# Altium schematic sheet CPU.SchDoc: MC9S12C128 Connection Schematic
size B; Date: 2015-02-08; Author: Marcin Czajkowski; Organization: Marcin Czajkowski; Address1: SN:3547684; Address2: ESE - Year2; Address3: Conestoga College; Address4: Project IV; DocumentNumber: 1; Revision: D; SheetNumber: 1; SheetTotal: 14
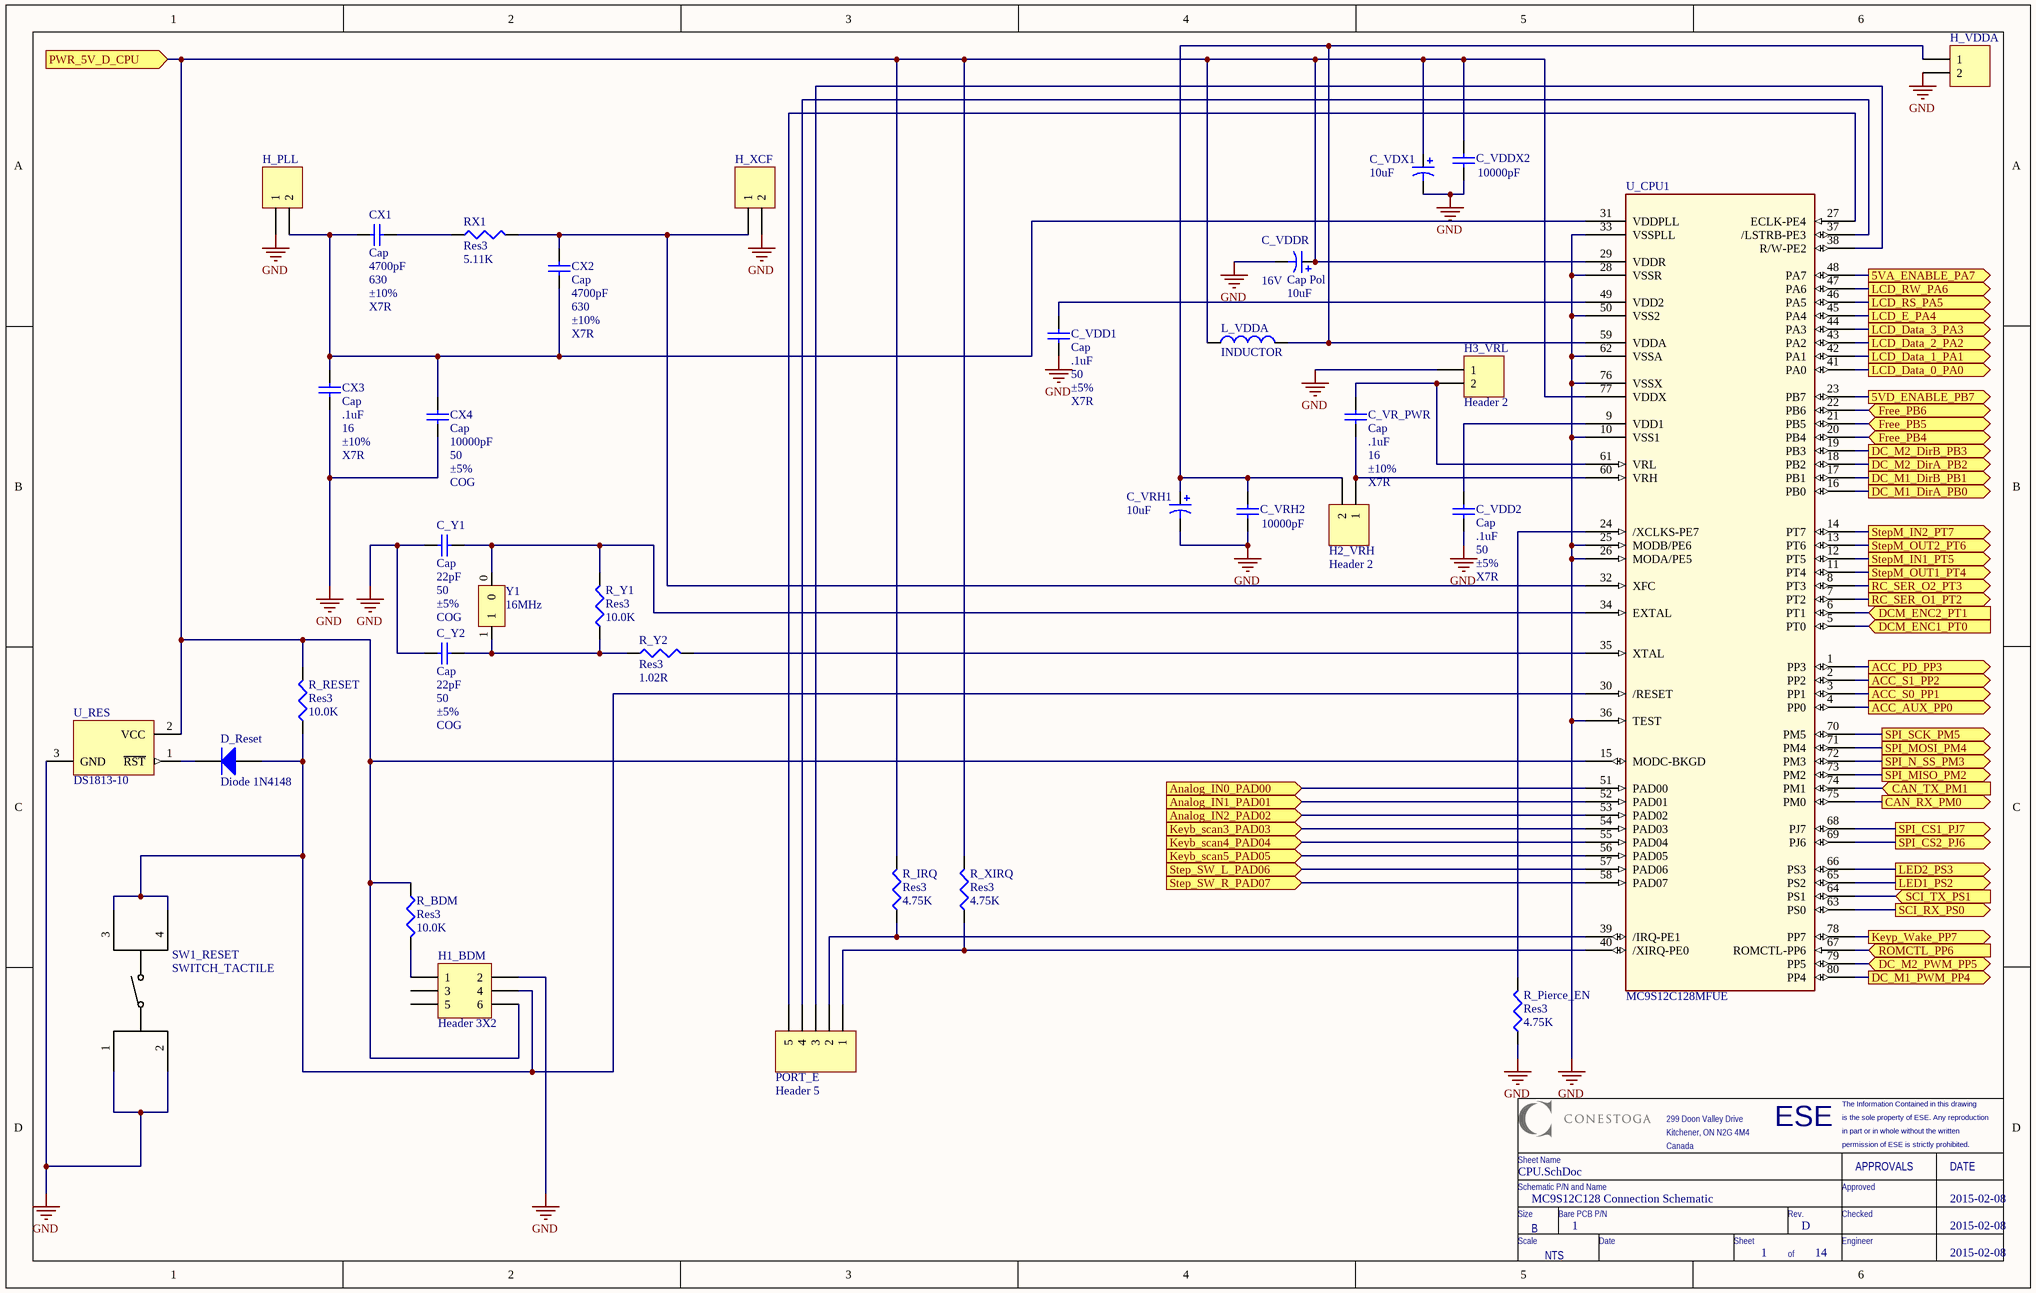
[diagram p0: CPU.SchDoc]

## Parts
C_VDD1  Cap  value .1uF  WV: 50  Tolerance: ±5%  Type: X7R  [CAPC2012X09M]
C_VDD2  Cap  value .1uF  WV: 50  Tolerance: ±5%  Type: X7R  [CAPC2012X09M]
C_VDDR  Cap Pol  value 10uF  Voltage: 16V  [CAPACITOR_3MM]
C_VDDX2  value 10000pF  [CAPC2012X09M]  (hidden comment: Cap)
C_VDX1  value 10uF  [CAPACITOR_3MM]  (hidden comment: Cap Pol)
C_VR_PWR  Cap  value .1uF  WV: 16  Tolerance: ±10%  Type: X7R  [CAPC2012X09M]
C_VRH1  value 10uF  [CAPACITOR_3MM]  (hidden comment: Cap Pol)
C_VRH2  value 10000pF  [CAPC2012X09M]  (hidden comment: Cap)
C_Y1  Cap  value 22pF  WV: 50  Tolerance: ±5%  Type: COG  [CAPC2012X09M]
C_Y2  Cap  value 22pF  WV: 50  Tolerance: ±5%  Type: COG  [CAPC2012X09M]
CX1  Cap  value 4700pF  WV: 630  Tolerance: ±10%  Type: X7R  [CAPC2012X09M]
CX2  Cap  value 4700pF  WV: 630  Tolerance: ±10%  Type: X7R  [CAPC2012X09M]
CX3  Cap  value .1uF  WV: 16  Tolerance: ±10%  Type: X7R  [CAPC2012X09M]
CX4  Cap  value 10000pF  WV: 50  Tolerance: ±5%  Type: COG  [CAPC2012X09M]
D_Reset  Diode 1N4148  [zener_sod323]
H1_BDM  Header 3X2  [HDR2X3]
H2_VRH  Header 2  [HDR1X2]
H3_VRL  Header 2  [HDR1X2]
H_PLL  Header 2  [HDR1X2]  (value not drawn)
H_VDDA  Header 2  [HDR1X2]  (value not drawn)
H_XCF  Header 2  [HDR1X2]  (value not drawn)
L_VDDA  INDUCTOR  [C1210]
PORT_E  Header 5  [HDR1X5]
R_BDM  Res3  value 10.0K  [RESC2112X05M]
R_IRQ  Res3  value 4.75K  [RESC2112X05M]
R_Pierce_EN  Res3  value 4.75K  [RESC2112X05M]
R_RESET  Res3  value 10.0K  [RESC2112X05M]
R_XIRQ  Res3  value 4.75K  [RESC2112X05M]
R_Y1  Res3  value 10.0K  [RESC2112X05M]
R_Y2  Res3  value 1.02R  [RESC2112X05M]
RX1  Res3  value 5.11K  [RESC2112X05M]
SW1_RESET  SWITCH_TACTILE  [TACT_SWITCH_6MM_SMT]
U_CPU1  MC9S12C128MFUE  [QUAD.65M/80/WG17.45-HCS12]
U_RES  DS1813-10  [SOT95P230X110-3M]
Y1  value 16MHz  [PCBComponent_1]  (hidden comment: ECS-160-20-5P)

## Ports
5VA_ENABLE_PA7 (out), 5VD_ENABLE_PB7 (out), ACC_AUX_PP0 (out), ACC_PD_PP3 (out), ACC_S0_PP1 (out), ACC_S1_PP2 (out), Analog_IN0_PAD00 (in), Analog_IN1_PAD01 (in), Analog_IN2_PAD02 (in), CAN_RX_PM0 (out), CAN_TX_PM1 (in), DC_M1_DirA_PB0 (out), DC_M1_DirB_PB1 (out), DC_M1_PWM_PP4 (out), DC_M2_DirA_PB2 (out), DC_M2_DirB_PB3 (out), DC_M2_PWM_PP5, DCM_ENC1_PT0 (in), DCM_ENC2_PT1 (in), Free_PB4 (bidir), Free_PB5 (bidir), Free_PB6 (bidir), Keyb_scan3_PAD03 (in), Keyb_scan4_PAD04 (in), Keyb_scan5_PAD05 (in), Keyp_Wake_PP7 (out), LCD_Data_0_PA0 (out), LCD_Data_1_PA1 (out), LCD_Data_2_PA2 (out), LCD_Data_3_PA3 (out), LCD_E_PA4 (out), LCD_RS_PA5 (out), LCD_RW_PA6 (out), LED1_PS2 (out), LED2_PS3 (out), PWR_5V_D_CPU (in), RC_SER_O1_PT2 (out), RC_SER_O2_PT3 (out), ROMCTL_PP6 (in), SCI_RX_PS0 (out), SCI_TX_PS1 (in), SPI_CS1_PJ7 (out), SPI_CS2_PJ6 (out), SPI_MISO_PM2 (out), SPI_MOSI_PM4 (out), SPI_N_SS_PM3 (out), SPI_SCK_PM5 (out), Step_SW_L_PAD06 (in), Step_SW_R_PAD07 (in), StepM_IN1_PT5 (out), StepM_IN2_PT7 (out), StepM_OUT1_PT4 (out), StepM_OUT2_PT6 (out)

## Nets
GND: C_VDD1.1 C_VDD2.1 C_VDDR.2 C_VDDX2.1 C_VDX1.2 C_VRH1.2 C_VRH2.1 C_Y1.1 C_Y2.1 CX3.1 CX4.1 H1_BDM.2 H3_VRL.1 H_PLL.1 H_VDDA.2 H_XCF.2 R_Pierce_EN.1 SW1_RESET.1 SW1_RESET.2 U_CPU1.10(VSS1) U_CPU1.25(MODB/PE6) U_CPU1.26(MODA/PE5) U_CPU1.28(VSSR) U_CPU1.33(VSSPLL) U_CPU1.36(TEST) U_CPU1.50(VSS2) U_CPU1.62(VSSA) U_CPU1.76(VSSX) U_RES.3(GND)
5VA_ENABLE_PA7: U_CPU1.48(PA7) ; port 5VA_ENABLE_PA7
5VD_ENABLE_PB7: U_CPU1.23(PB7) ; port 5VD_ENABLE_PB7
ACC_AUX_PP0: U_CPU1.4(PP0) ; port ACC_AUX_PP0
ACC_PD_PP3: U_CPU1.1(PP3) ; port ACC_PD_PP3
ACC_S0_PP1: U_CPU1.3(PP1) ; port ACC_S0_PP1
ACC_S1_PP2: U_CPU1.2(PP2) ; port ACC_S1_PP2
Analog_IN0_PAD00: U_CPU1.51(PAD00) ; port Analog_IN0_PAD00
Analog_IN1_PAD01: U_CPU1.52(PAD01) ; port Analog_IN1_PAD01
Analog_IN2_PAD02: U_CPU1.53(PAD02) ; port Analog_IN2_PAD02
CAN_RX_PM0: U_CPU1.75(PM0) ; port CAN_RX_PM0
CAN_TX_PM1: U_CPU1.74(PM1) ; port CAN_TX_PM1
DC_M1_DirA_PB0: U_CPU1.16(PB0) ; port DC_M1_DirA_PB0
DC_M1_DirB_PB1: U_CPU1.17(PB1) ; port DC_M1_DirB_PB1
DC_M1_PWM_PP4: U_CPU1.80(PP4) ; port DC_M1_PWM_PP4
DC_M2_DirA_PB2: U_CPU1.18(PB2) ; port DC_M2_DirA_PB2
DC_M2_DirB_PB3: U_CPU1.19(PB3) ; port DC_M2_DirB_PB3
DC_M2_PWM_PP5: U_CPU1.79(PP5) ; port DC_M2_PWM_PP5
DCM_ENC1_PT0: U_CPU1.5(PT0) ; port DCM_ENC1_PT0
DCM_ENC2_PT1: U_CPU1.6(PT1) ; port DCM_ENC2_PT1
Free_PB4: U_CPU1.20(PB4) ; port Free_PB4
Free_PB5: U_CPU1.21(PB5) ; port Free_PB5
Free_PB6: U_CPU1.22(PB6) ; port Free_PB6
Keyb_scan3_PAD03: U_CPU1.54(PAD03) ; port Keyb_scan3_PAD03
Keyb_scan4_PAD04: U_CPU1.55(PAD04) ; port Keyb_scan4_PAD04
Keyb_scan5_PAD05: U_CPU1.56(PAD05) ; port Keyb_scan5_PAD05
Keyp_Wake_PP7: U_CPU1.78(PP7) ; port Keyp_Wake_PP7
LCD_Data_0_PA0: U_CPU1.41(PA0) ; port LCD_Data_0_PA0
LCD_Data_1_PA1: U_CPU1.42(PA1) ; port LCD_Data_1_PA1
LCD_Data_2_PA2: U_CPU1.43(PA2) ; port LCD_Data_2_PA2
LCD_Data_3_PA3: U_CPU1.44(PA3) ; port LCD_Data_3_PA3
LCD_E_PA4: U_CPU1.45(PA4) ; port LCD_E_PA4
LCD_RS_PA5: U_CPU1.46(PA5) ; port LCD_RS_PA5
LCD_RW_PA6: U_CPU1.47(PA6) ; port LCD_RW_PA6
LED1_PS2: U_CPU1.65(PS2) ; port LED1_PS2
LED2_PS3: U_CPU1.66(PS3) ; port LED2_PS3
PWR_5V_D_CPU: C_VDDR.1 C_VDDX2.2 C_VDX1.1 H1_BDM.6 L_VDDA.1 R_BDM.1 R_IRQ.2 R_RESET.2 R_XIRQ.2 U_CPU1.15(MODC-BKGD) U_CPU1.29(VDDR) U_CPU1.77(VDDX) U_RES.2(VCC) ; port PWR_5V_D_CPU
RC_SER_O1_PT2: U_CPU1.7(PT2) ; port RC_SER_O1_PT2
RC_SER_O2_PT3: U_CPU1.8(PT3) ; port RC_SER_O2_PT3
ROMCTL_PP6: U_CPU1.67(ROMCTL-PP6) ; port ROMCTL_PP6
SCI_RX_PS0: U_CPU1.63(PS0) ; port SCI_RX_PS0
SCI_TX_PS1: U_CPU1.64(PS1) ; port SCI_TX_PS1
SPI_CS1_PJ7: U_CPU1.68(PJ7) ; port SPI_CS1_PJ7
SPI_CS2_PJ6: U_CPU1.69(PJ6) ; port SPI_CS2_PJ6
SPI_MISO_PM2: U_CPU1.73(PM2) ; port SPI_MISO_PM2
SPI_MOSI_PM4: U_CPU1.71(PM4) ; port SPI_MOSI_PM4
SPI_N_SS_PM3: U_CPU1.72(PM3) ; port SPI_N_SS_PM3
SPI_SCK_PM5: U_CPU1.70(PM5) ; port SPI_SCK_PM5
Step_SW_L_PAD06: U_CPU1.57(PAD06) ; port Step_SW_L_PAD06
Step_SW_R_PAD07: U_CPU1.58(PAD07) ; port Step_SW_R_PAD07
StepM_IN1_PT5: U_CPU1.12(PT5) ; port StepM_IN1_PT5
StepM_IN2_PT7: U_CPU1.14(PT7) ; port StepM_IN2_PT7
StepM_OUT1_PT4: U_CPU1.11(PT4) ; port StepM_OUT1_PT4
StepM_OUT2_PT6: U_CPU1.13(PT6) ; port StepM_OUT2_PT6
NetC_VDD1_2: C_VDD1.2 U_CPU1.49(VDD2)
NetC_VDD2_2: C_VDD2.2 U_CPU1.9(VDD1)
NetC_VR_PWR_1: C_VR_PWR.1 H2_VRH.1 U_CPU1.60(VRH)
NetC_VR_PWR_2: C_VR_PWR.2 H3_VRL.2 U_CPU1.61(VRL)
NetC_VRH1_1: C_VRH1.1 C_VRH2.2 H2_VRH.2 H_VDDA.1 L_VDDA.2 U_CPU1.59(VDDA)
NetC_Y1_2: C_Y1.2 R_Y1.2 U_CPU1.34(EXTAL) Y1.0
NetC_Y2_2: C_Y2.2 R_Y1.1 R_Y2.1 Y1.1
NetCX1_1: CX1.1 CX2.1 CX3.2 CX4.2 H_PLL.2 U_CPU1.31(VDDPLL)
NetCX1_2: CX1.2 RX1.1
NetCX2_2: CX2.2 H_XCF.1 RX1.2 U_CPU1.32(XFC)
NetD_Reset_A: D_Reset.A H1_BDM.4 R_RESET.1 SW1_RESET.3 SW1_RESET.4 U_CPU1.30(/RESET)
NetD_Reset_K: D_Reset.K U_RES.1(~{RST})
NetH1_BDM_1: H1_BDM.1 R_BDM.2
NetPORT_E_1: PORT_E.1 R_XIRQ.1 U_CPU1.40(/XIRQ-PE0)
NetPORT_E_2: PORT_E.2 R_IRQ.1 U_CPU1.39(/IRQ-PE1)
NetPORT_E_3: PORT_E.3 U_CPU1.38(R/W-PE2)
NetPORT_E_4: PORT_E.4 U_CPU1.37(/LSTRB-PE3)
NetPORT_E_5: PORT_E.5 U_CPU1.27(ECLK-PE4)
NetR_Pierce_EN_2: R_Pierce_EN.2 U_CPU1.24(/XCLKS-PE7)
NetR_Y2_2: R_Y2.2 U_CPU1.35(XTAL)

Not connected (* = marked no-connect by the designer): H1_BDM 3 5

## Notes on the sheet
- ESE
- is the sole property of ESE. Any reproduction
- The Information Contained in this drawing
- Schematic P/N and Name
- Sheet Name
- 299 Doon Valley Drive
- Kitchener, ON N2G 4M4
- Canada
- Approved
- in part or in whole without the written
- permission of ESE is strictly prohibited.
- APPROVALS
- DATE
- Size
- Scale
- B
- NTS
- Bare PCB P/N
- Date
- Sheet
- Rev.
- Checked
- Engineer
- of

## Library data of the parts
C_VDD1 C_VDD2 = CAP-X7R-.1uF-50V-±5%: CAP CER .1uF 50v X7R 0805; MPN: C0805C104J5RACTU; PN: 399-1171-1-ND; Name: CAP-X7R-.1uF-50V-±5%; URL: http://www.digikey.ca/product-detail/en/C0805C104J5RACTU/399-1171-1-ND
C_VDDR C_VDX1 C_VRH1 = Cap Polar-10uF-16V: CAP 85C 10uF ±20% 16V WX Series Aluminum Electrolytic; MPN: UWX1C100MCL2GB; Tan Theta: 0.16; Leakage Current: 3; Rated Ripple Current: 18; PN: 493-2099-1-ND; Name: Cap Polar-10uF-16V; Diameter: 3; URL: http://www.digikey.ca/product-detail/en/UWX1C100MCL2GB/493-2099-1-ND
  C_VDX1 C_VRH1: Voltage: 16V
C_VDDX2 C_VRH2 = CAP-X7R-10000pF-50V-±10%: CAP CER 10000pF 50v X7R 0805; MPN: C0805C103K5RACTU; WV: 50; Tolerance: ±10%; PN: 399-1158-1-ND; Name: CAP-X7R-10000pF-50V-±10%; Type: X7R; URL: http://www.digikey.ca/product-detail/en/C0805C103K5RACTU/399-1158-1-ND
C_VR_PWR CX3 = CAP-X7R-.1uF-16V-±10%: CAP CER .1uF 16v X7R 0805; MPN: C0805C104K4RACTU; PN: 399-1167-1-ND; Name: CAP-X7R-.1uF-16V-±10%; URL: http://www.digikey.ca/product-detail/en/C0805C104K4RACTU/399-1167-1-ND
C_Y1 C_Y2 = CAP-COG-22pF-50V-±5%: CAP CER 22pF 50v COG 0805; MPN: C0805C220J5GACTU; PN: 399-1113-1-ND; Name: CAP-COG-22pF-50V-±5%; URL: http://www.digikey.ca/product-detail/en/C0805C220J5GACTU/399-1113-1-ND
CX1 CX2 = CAP-X7R-4700pF-630V-±10%: CAP CER 4700pF 630v X7R 1210; MPN: C1210C472KBRACTU; PN: 399-5595-1-ND; Name: CAP-X7R-4700pF-630V-±10%; URL: http://www.digikey.ca/product-detail/en/C1210C472KBRACTU/399-5595-1-ND
CX4 = CAP-COG-10000pF-50V-±5%: CAP CER 10000pF 50v COG 1210; MPN: C1210C103J5GACTU; PN: 399-1266-1-ND; Name: CAP-COG-10000pF-50V-±5%; URL: http://www.digikey.ca/product-detail/en/C1210C103J5GACTU/399-1266-1-ND
D_Reset = Diode 1N4148: High Conductance Fast Diode; MPN: 1N4148WX-TP; PN: 1N4148WXTPMSCT-ND; URL: http://www.digikey.ca/product-detail/en/1N4148WX-TP/1N4148WXTPMSCT-ND
H1_BDM = Header 3X2: Header, 3-Pin, Dual row; LatestRevisionDate: 17-Jul-2002; LatestRevisionNote: Re-released for DXP Platform.; Publisher: Altium Limited; DigikeyWeb: http://www.digikey.ca/product-detail/en/M20-9980346/952-2121-ND/3728085; Digikey#: 952-2121-ND
H2_VRH H3_VRL H_PLL H_VDDA H_XCF = Header 2: Header, 2-Pin; MPN: PEC02SFAN; PN: S1212E-02-ND; URL: http://www.digikey.ca/product-detail/en/PEC04SFAN/S1212E-02-ND
PORT_E = Header 5: Header, 5-Pin; MPN: PEC05SFAN; PN: S1212E-05-ND; URL: http://www.digikey.ca/product-detail/en/PEC05SFAN/S1212E-05-ND/859446
R_BDM R_RESET R_Y1 = Resistor_10.0K: RES SMD 10.0K OHM 1% 1/8W 0805; MPN: CRCW080510K0FKEA; PN: 541-10.0KCCT-ND; Name: Resistor_10.0K; URL: http://www.digikey.ca/product-detail/en/CRCW080510K0FKEA/541-10.0KCCT-ND
R_IRQ R_Pierce_EN R_XIRQ = Resistor_4.75K: RES SMD 4.75K OHM 1% 1/8W 0805; MPN: CRCW08054K75FKEA; PN: 541-4.75KCCT-ND; Name: Resistor_4.75K; URL: http://www.digikey.ca/product-detail/en/CRCW08054K75FKEA/541-4.75KCCT-ND
R_Y2 = Resistor_1.02R: RES SMD 1.02R OHM 1% 1/8W 0805; MPN: CRCW08051R02FKEA; PN: 541-1.02CCCT-ND; Name: Resistor_1.02R; URL: http://www.digikey.ca/product-detail/en/CRCW08051R02FKEA/541-1.02CCCT-ND
RX1 = Resistor_5.11K: RES SMD 5.11K OHM 1% 1/8W 0805; MPN: CRCW08055K11FKEA; PN: 541-5.11KCCT-ND; Name: Resistor_5.11K; URL: http://www.digikey.ca/product-detail/en/CRCW08055K11FKEA/541-5.11KCCT-ND
SW1_RESET = SWITCH_TACTILE: SWITCH TACTILE SPST-NO 0.05A 12V; MPN: PTS645SH50SMTR92 LFS; PN: CKN9085CT-ND; URL: http://www.digikey.ca/product-detail/en/PTS645SH50SMTR92%20LFS/CKN9085CT-ND
U_CPU1 = MC9S12C128MFUE: IC MCU 16BIT 128KB FLASH 80QFP; MPN: MC9S12C32CFUE25; PN: MC9S12C32CFUE25-ND; URL: http://www.digikey.ca/product-detail/en/MC9S12C32CFUE25/MC9S12C32CFUE25-ND
U_RES = DS1813-10: 5V EconoReset with Pushbutton; MPN: DS1813R-10+T&R; PN: DS1813R-10+T&RCT-ND; Published: 13-Oct-2000; LatestRevisionDate: 17-Jul-2002; LatestRevisionNote: Re-released for DXP Platform.; DatasheetVersion: 7-May-1998; PackageVersion: Feb-1999; PackageReference: TO-92; Publisher: Altium Limited; PackageDescription: TO, Flat Index; 3 In-Line, Axial Leads; Body Dia. 4.7mm; Leads 0.56 x 0.51 mm (max); ComponentLink1Description: Manufacturer Link; ComponentLink1URL: http://www.maxim-ic.com/; ComponentLink2Description: Datasheet; ComponentLink2URL: http://pdfserv.maxim-ic.com/en/ds/DS1813.pdf; URL: http://www.digikey.ca/product-detail/en/DS1813R-10%2BT%26R/DS1813R-10%2BT%26RCT-ND
L_VDDA = INDUCTOR: DigikeyWeb: http://www.digikey.ca/product-detail/en/IMC1210SY100K/541-1673-1-ND/3622241; Digikey#: 541-1673-1-ND
Y1 = ECS-160-20-5P: DigikeyWeb: http://www.digikey.ca/product-detail/en/ECS-160-20-5P-TR/XC694CT-ND/38747; Digikey#: XC694CT-ND